# Altium project eps2_project.prjpcb (part 9 of 9)

## Sheet 6_battery_heater_controller.schdoc: Batteries Heater Controller and RTD ADC
size A4; Designed by: Andre M. P. Mattos; ProjectRevision: v0.3; Organization: UFSC; DocumentNumber: 7; Revision: v0.3; SheetNumber: 7; SheetTotal: 11; ProjectCode: EPS2
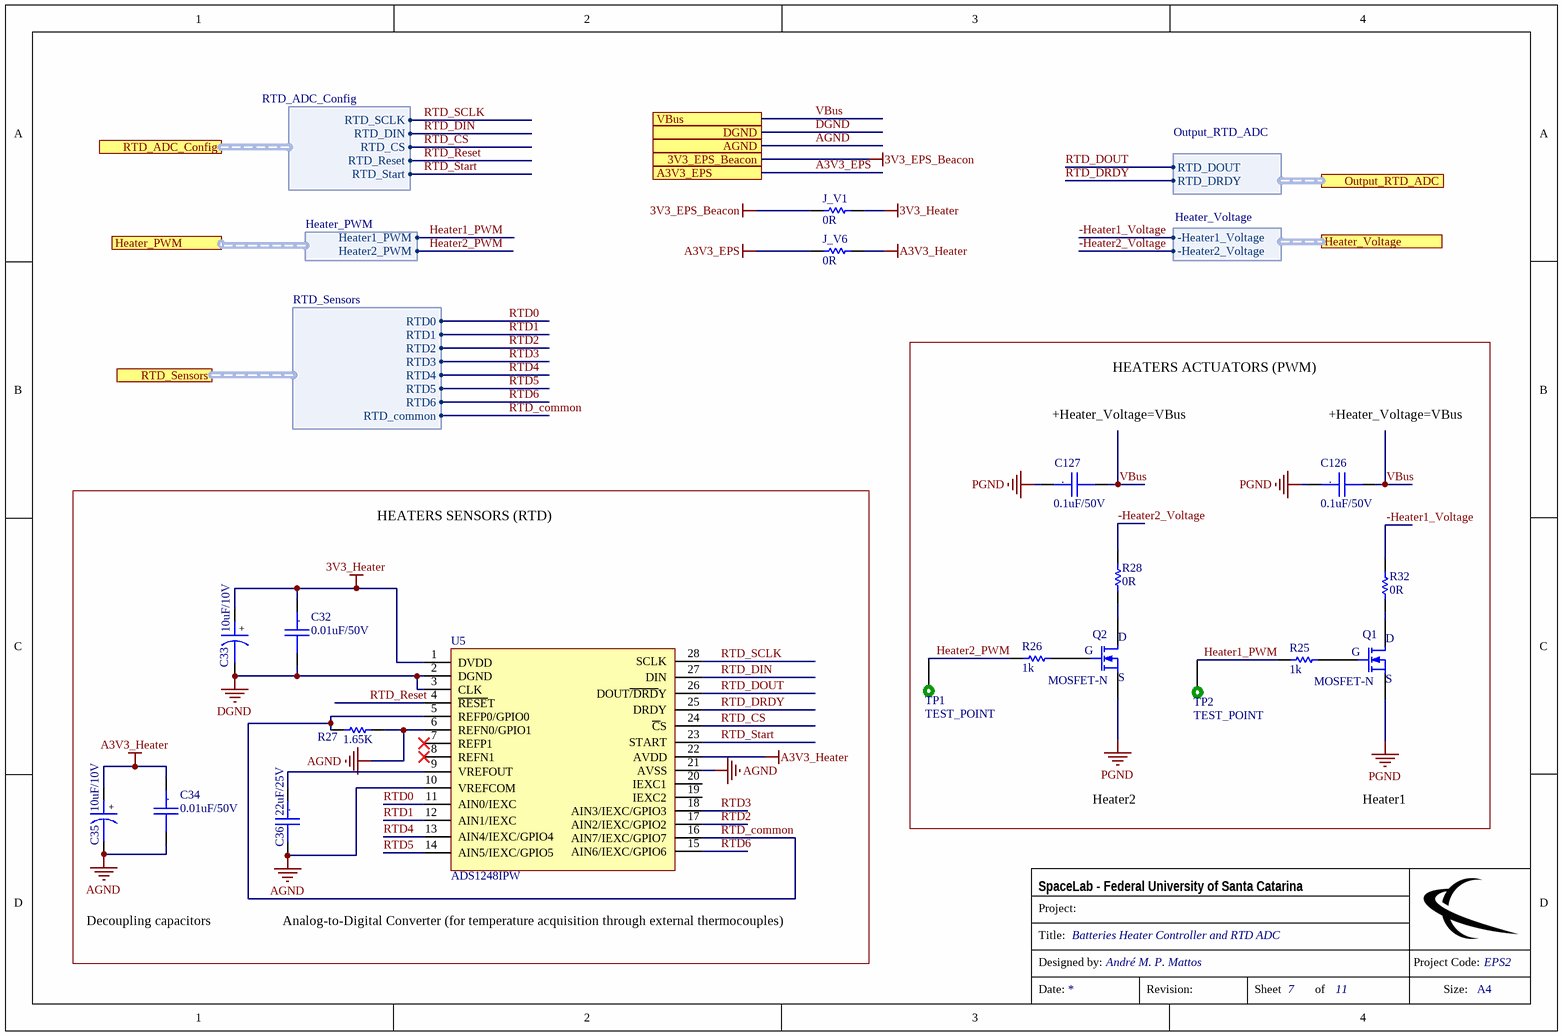
[diagram p10: 6_battery_heater_controller.schdoc]

### Parts
C32  0.01uF/50V  [CC0805]
C33  10uF/10V  [CC0805_Tantalum]
C34  0.01uF/50V  [CC0805]
C35  10uF/10V  [CC0805_Tantalum]
C36  22uF/25V  [CC1210]
C126  0.1uF/50V  [CC0805]
C127  0.1uF/50V  [CC0805]
J_V1  0R  [0805]
J_V6  0R  [0805]
Q1  MOSFET-N  [SOIC8_Mosfet]
Q2  MOSFET-N  [SOIC8_Mosfet]
R25  1k  [0805]
R26  1k  [0805]
R27  1.65K  [0805]
R28  0R  [0805]
R32  0R  [0805]
TP1  TEST_POINT  [TEST_POINT]  (no BOM)
TP2  TEST_POINT  [TEST_POINT]  (no BOM)
U5  ADS1248IPW  [TSSOP28]

### Blocks framed on the sheet
HEATERS ACTUATORS (PWM): C126 C127 Q1 Q2 R25 R26 R28 R32 TP1 TP2
HEATERS SENSORS (RTD): C32-C36 R27 U5

### Ports
3V3_EPS_Beacon, A3V3_EPS, AGND, DGND, Heater_PWM (harness Heater_PWM), Heater_Voltage (harness Heater_Voltage), Output_RTD_ADC (harness Output_RTD_ADC), RTD_ADC_Config (harness RTD_ADC_Config), RTD_Sensors (harness RTD_Sensors), VBus

### Harnesses
Output_RTD_ADC: RTD_DOUT, RTD_DRDY
RTD_ADC_Config: RTD_SCLK, RTD_DIN, RTD_CS, RTD_Reset, RTD_Start
RTD_Sensors: RTD1, RTD2, RTD3, RTD4, RTD5, RTD6, RTD0, RTD_common
Heater_PWM: Heater1_PWM, Heater2_PWM
Heater_Voltage: -Heater1_Voltage, -Heater2_Voltage

### Nets
3V3_EPS_Beacon: J_V1.2 ; port 3V3_EPS_Beacon
3V3_Heater: C32.1 C33.1 J_V1.1 U5.1(DVDD)
A3V3_EPS: J_V6.2 ; port A3V3_EPS
A3V3_Heater: C34.1 C35.1 J_V6.1 U5.22(AVDD)
AGND: C34.2 C35.2 C36.2 R27.1 U5.6(REFN0/GPIO1) U5.10(VREFCOM) U5.21(AVSS) ; port AGND
DGND: C32.2 C33.2 U5.2(DGND) U5.3(CLK) ; port DGND
PGND: C126.1 C127.1 Q1.1(S) Q2.1(S)
-Heater1_Voltage: R32.1 ; port Heater_Voltage.-Heater1_Voltage
-Heater2_Voltage: R28.1 ; port Heater_Voltage.-Heater2_Voltage
Heater1_PWM: R25.2 TP2.1 ; port Heater_PWM.Heater1_PWM
Heater2_PWM: R26.2 TP1.1 ; port Heater_PWM.Heater2_PWM
RTD0: U5.11(AIN0/IEXC) ; port RTD_Sensors.RTD0
RTD1: U5.12(AIN1/IEXC) ; port RTD_Sensors.RTD1
RTD2: U5.17(AIN2/IEXC/GPIO2) ; port RTD_Sensors.RTD2
RTD3: U5.18(AIN3/IEXC/GPIO3) ; port RTD_Sensors.RTD3
RTD4: U5.13(AIN4/IEXC/GPIO4) ; port RTD_Sensors.RTD4
RTD5: U5.14(AIN5/IEXC/GPIO5) ; port RTD_Sensors.RTD5
RTD6: U5.15(AIN6/IEXC/GPIO6) ; port RTD_Sensors.RTD6
RTD_common: R27.2 U5.5(REFP0/GPIO0) U5.16(AIN7/IEXC/GPIO7) ; port RTD_Sensors.RTD_common
RTD_CS: U5.24(~{C}S) ; port RTD_ADC_Config.RTD_CS
RTD_DIN: U5.27(DIN) ; port RTD_ADC_Config.RTD_DIN
RTD_DOUT: U5.26(DOUT~{/DRD}Y) ; port Output_RTD_ADC.RTD_DOUT
RTD_DRDY: U5.25(DRDY) ; port Output_RTD_ADC.RTD_DRDY
RTD_Reset: U5.4(~{RESE}T) ; port RTD_ADC_Config.RTD_Reset
RTD_SCLK: U5.28(SCLK) ; port RTD_ADC_Config.RTD_SCLK
RTD_Start: U5.23(START) ; port RTD_ADC_Config.RTD_Start
VBus: C126.2 C127.2 ; port VBus
NetC36_1: C36.1 U5.9(VREFOUT)
NetQ1_2: Q1.2(G) R25.1
NetQ1_3: Q1.3(D) R32.2
NetQ2_2: Q2.2(G) R26.1
NetQ2_3: Q2.3(D) R28.2

Not connected (* = marked no-connect by the designer): U5 7(REFP1)* 8(REFN1)* 19(IEXC2) 20(IEXC1)

### Notes on the sheet
- +Heater_Voltage=VBus
- Heater2
- Heater1
- Decoupling capacitors
- Analog-to-Digital Converter (for temperature acquisition through external thermocouples)
- Project:
- SpaceLab - Federal University of Santa Catarina
- Title:
- Designed by:
- Project Code:
- Date:
- Revision:
- Sheet
- of
- Size:
- A4
- (in symbol Cap_Cer_X7R_0.01uF_50V_0805) .
- (in symbol Cap_Cer_X7R_0.1uF_50V_0805) .
- (in symbol Cap_Cer_X7R_22uF_25V_1210) .
- (in symbol Cap_Tant_SMD_10uF_6V3_0805) +

### Library data of the parts
C32 C34 = Cap_Cer_X7R_0.01uF_50V_0805: CAP CER 0.01uF 50V 10% X7R 0805; Partnumber: 08055C103KAT4A; Manufacturer: Kyocera AVX; Capacitance: 10nF; NCM: 8532.24.10; Case/Package: 0805; Case Code (Imperial): 0805; Case Code (Metric): 2012; ComponentLink1Description: http://www.mouser.com/ds/2/40/X7RDielectric-777024.pdf?src-supplier=Mouser; ComponentLink1URL: http://www.mouser.com/ds/2/40/X7RDielectric-777024.pdf?src-supplier=Mouser; ComponentLink2Description: http://www.avx.com/docs/Catalogs/cx7r.pdf?src-supplier=Future+Electronics; ComponentLink2URL: http://www.avx.com/docs/Catalogs/cx7r.pdf?src-supplier=Future+Electronics; Depth: 1.25mm; Dielectric: X7R; Height: 0.94mm; Lead Free: Lead Free; Length: 2.01mm; Manufacturer Part Number: 08055C103KAT4A; Max Operating Temperature: 125°C; Min Operating Temperature: -55°C; Mount: Surface Mount; Number of Pins: 2; Packaging: Tape and Reel; Pricing 1: 1=0.12, 10=0.085, 100=0.04, 500=0.028, 1000=0.023, 2500=0.018 (USD); Pricing 2: 1=0.13, 10=0.09, 50=0.0508, 100=0.0421, 500=0.02952, 1000=0.02444, 2500=0.02275, 5000=0.02081 (USD); Radiation Hardening: No; Stock 1: 88198; Stock 2: 515319; Supplier 1: Mouser; Supplier 2: Digi-Key; Supplier Part Number 1: 581-08055C103KAT4A; Supplier Part Number 2: 478-10687-1-ND; Termination: SMD/SMT; Tolerance: 10%; Voltage: 50V; Voltage Rating (DC): 50V; Voltage Rating: 50V; Weight: 0.000194oz; Width: 1.25mm
C33 C35 = Cap_Tant_SMD_10uF_6V3_0805: CAP Tantalum 10uF 6.3V 10% 0805; Partnumber: TPSR106K006R1000; Manufacturer: Kyocera AVX; Dissipation Factor: 8%; ESR (Equivalent Series Resistance): 1R; Polarity: Polar; NCM: 8532.21.11; Capacitance: 10uF; Case/Package: 0805; Case Code (Imperial): 0805; Case Code (Metric): 2012; ComponentLink1Description: http://www.avx.com/docs/Catalogs/packmark.pdf?src-supplier=Element14; ComponentLink1URL: http://www.avx.com/docs/Catalogs/packmark.pdf?src-supplier=Element14; ComponentLink2Description: http://www.farnell.com/datasheets/1441576.pdf?src-supplier=Element14; ComponentLink2URL: http://www.farnell.com/datasheets/1441576.pdf?src-supplier=Element14; ComponentLink3Description: http://datasheets.avx.com/TPS.pdf?src-supplier=Digi-Key; ComponentLink3URL: http://datasheets.avx.com/TPS.pdf?src-supplier=Digi-Key; Depth: 1.3mm; Dielectric Material: Tantalum; Features: General Purpose; Height - Seated (Max): 0.047inch; Height: 1.2mm; Lead Free: Lead Free; Length: 2.05mm; Manufacturer Part Number: TPSR106K006R1000; Max Operating Temperature: 125°C; Min Operating Temperature: -55°C; Mount: Surface Mount; Package Quantity: 1; Packaging: Tape and Reel; Pricing 1: 1=0.76, 10=0.561, 100=0.384, 500=0.304, 1000=0.256, 2500=0.237 (USD); Pricing 2: 1=0.73, 10=0.536, 50=0.429, 100=0.3678, 500=0.29114, 1000=0.24517 (USD); Radiation Hardening: No; REACH SVHC: No SVHC; Stock 1: 0; Stock 2: 0; Supplier 1: Mouser; Supplier 2: Digi-Key; Supplier Part Number 1: 581-TPSR106K006R1000; Supplier Part Number 2: 478-9265-1-ND; Termination: SMD/SMT; Tolerance: 10%; Voltage Rating: 6.3V; Width: 0.051inch
C36 = Cap_Cer_X7R_22uF_25V_1210: CAP CER 22uF 25V 10% X7R 1210; Partnumber: GRM32ER71E226KE15L; Manufacturer: Murata; Material: Ceramic; Capacitance: 22uF; Case/Package: 1210; Case Code (Imperial): 1210; Case Code (Metric): 3225; ComponentLink1Description: http://www.farnell.com/datasheets/2048964.pdf?src-supplier=Farnell; ComponentLink1URL: http://www.farnell.com/datasheets/2048964.pdf?src-supplier=Farnell; ComponentLink2Description: http://psearch.murata.com/capacitor/product/GRM32ER71E226KE15%23.pdf?src-supplier=Future+Electronics; ComponentLink2URL: http://psearch.murata.com/capacitor/product/GRM32ER71E226KE15%23.pdf?src-supplier=Future+Electronics; ComponentLink3Description: https://www.murata.com/~/media/webrenewal/support/library/catalog/products/capacitor/mlcc/c02e.ashx?la=en-us&src-supplier=Digi-Key; ComponentLink3URL: https://www.murata.com/~/media/webrenewal/support/library/catalog/products/capacitor/mlcc/c02e.ashx?la=en-us&src-supplier=Digi-Key; ComponentLink4Description: http://components.arrow.com/part/dataview/47905228S8888111N2606?src-supplier=Arrow; ComponentLink4URL: http://components.arrow.com/part/dataview/47905228S8888111N2606?src-supplier=Arrow; ComponentLink5Description: http://www.farnell.com/datasheets/2048964.pdf?src-supplier=Element14; ComponentLink5URL: http://www.farnell.com/datasheets/2048964.pdf?src-supplier=Element14; ComponentLink6Description: http://uk.rs-online.com/webdocs/13d2/0900766b813d2caa.pdf?src-supplier=RSComponents; ComponentLink6URL: http://uk.rs-online.com/webdocs/13d2/0900766b813d2caa.pdf?src-supplier=RSComponents; ComponentLink7Description: https://produktinfo.conrad.com/datenblaetter/450000-474999/451826-da-01-de-VS_KONDENS_GRM32_ER71E_226KE15L.pdf?src-supplier=Conrad; ComponentLink7URL: https://produktinfo.conrad.com/datenblaetter/450000-474999/451826-da-01-de-VS_KONDENS_GRM32_ER71E_226KE15L.pdf?src-supplier=Conrad; Depth: 2.5mm; Dielectric: X7R; Height: 2.5mm; Lead Free: Lead Free; Length: 3.2mm; Manufacturer Part Number: GRM32ER71E226KE15L; Max Operating Temperature: 125°C; Min Operating Temperature: -55°C; Mount: Surface Mount; Number of Pins: 2; Package Quantity: 1; Packaging: Tape and Reel; Pricing 1: 1=1.96, 10=1.54, 25=1.54, 100=1.15, 250=1.15, 500=0.876 (USD); Pricing 2: 1=1.87, 10=1.479, 50=1.2816, 100=1.1091, 500=0.83802 (USD); Radiation Hardening: No; REACH SVHC: No SVHC; Stock 1: 169862; Stock 2: 0; Supplier 1: Mouser; Supplier 2: Digi-Key; Supplier Part Number 1: 81-GRM32ER71E226KE5L; Supplier Part Number 2: 490-5313-1-ND; Termination: SMD/SMT; Thickness: 0.106inch; Tolerance: 10%; Voltage: 25V; Voltage Rating (DC): 25V; Voltage Rating: 25V; Width: 0.098inch
C126 C127 = Cap_Cer_X7R_0.1uF_50V_0805: CAP CER 0.1UF 50V 10% X7R 0805; Partnumber: CC0805KRX7R9BB104; Manufacturer: Yageo; Capacitance: 100nF; Insulation Resistance: 100GR; Material: Ceramic; Case/Package: 0805; Case Code (Imperial): 0805; Case Code (Metric): 2012; ComponentLink1Description: http://www.yageo.com/documents/recent/UPY-GPHC_X7R_6.3V-to-50V_8.pdf?src-supplier=Avnet; ComponentLink1URL: http://www.yageo.com/documents/recent/UPY-GPHC_X7R_6.3V-to-50V_8.pdf?src-supplier=Avnet; ComponentLink2Description: http://www.farnell.com/datasheets/1489800.pdf?src-supplier=Element14; ComponentLink2URL: http://www.farnell.com/datasheets/1489800.pdf?src-supplier=Element14; ComponentLink3Description: http://www.yageo.com/documents/recent/UPY-GPHC_X7R_6.3V-to-50V_18.pdf?src-supplier=Digi-Key; ComponentLink3URL: http://www.yageo.com/documents/recent/UPY-GPHC_X7R_6.3V-to-50V_18.pdf?src-supplier=Digi-Key; ComponentLink4Description: http://www.farnell.com/datasheets/2167236.pdf?src-supplier=Element14; ComponentLink4URL: http://www.farnell.com/datasheets/2167236.pdf?src-supplier=Element14; ComponentLink5Description: http://www.yageo.com/documents/recent/UPY-GPHC_X7R_6.3V-to-50V_8.pdf?src-supplier=Avnet+Europe; ComponentLink5URL: http://www.yageo.com/documents/recent/UPY-GPHC_X7R_6.3V-to-50V_8.pdf?src-supplier=Avnet+Europe; ComponentLink6Description: http://www.produktinfo.conrad.com/datenblaetter/425000-449999/445210-da-01-en-KERKO_CHIP_0805_X7R_0_1uF_10Proz_50VG.pdf?src-supplier=Conrad; ComponentLink6URL: http://www.produktinfo.conrad.com/datenblaetter/425000-449999/445210-da-01-en-KERKO_CHIP_0805_X7R_0_1uF_10Proz_50VG.pdf?src-supplier=Conrad; Depth: 1.25mm; Dielectric: X7R; Halogen Free: Halogen Free; Height: 0.85mm; Lead Free: Lead Free; Length: 2mm; Manufacturer Part Number: CC0805KRX7R9BB104; Max Operating Temperature: 125°C; Min Operating Temperature: -55°C; Mount: Surface Mount; Number of Pins: 2; Package Quantity: 1; Packaging: Tape and Reel; Pricing 1: 1=0.12, 10=0.087, 100=0.028, 1000=0.023, 4000=0.018, 8000=0.017 (USD); Pricing 2: 1=0.12, 10=0.088, 50=0.05, 100=0.0414, 500=0.02906, 1000=0.02405 (USD); Radiation Hardening: No; REACH SVHC: No SVHC; Stock 1: 3904445; Stock 2: 544494; Supplier 1: Mouser; Supplier 2: Digi-Key; Supplier Part Number 1: 603-CC805KRX7R9BB104; Supplier Part Number 2: 311-1140-1-ND; Termination: SMD/SMT; Thickness: 0.033inch; Tolerance: 10%; Voltage: 50V; Voltage Rating: 50V; Width: 0.049inch
J_V1 J_V6 R28 R32 = R0R_JUMPER_1/8W_0805: RES 0R OHM 1/8W JUMPER 0805; Partnumber: CRCW08050000Z0EA; Manufacturer: Vishay; Max Power Dissipation: 125mW; Resistance: 0mR; Temperature Coefficient: 100ppm/°C; Tolerance: 1%; Voltage Rating (DC): 150V; Fitted: No (jumper resistor); Case/Package: 0805; Case Code (Imperial): 0805; Case Code (Metric): 2012; ComponentLink1Description: http://www.vishay.com/docs/20035/dcrcwe3.pdf?src-supplier=Avnet+Europe; ComponentLink1URL: http://www.vishay.com/docs/20035/dcrcwe3.pdf?src-supplier=Avnet+Europe; ComponentLink2Description: http://www.vishay.com/docs/20035/dcrcwe3.pdf?src-supplier=Distrelec; ComponentLink2URL: http://www.vishay.com/docs/20035/dcrcwe3.pdf?src-supplier=Distrelec; ComponentLink3Description: http://www.vishay.com/docs/20035/dcrcwe3.pdf?src-supplier=Mouser; ComponentLink3URL: http://www.vishay.com/docs/20035/dcrcwe3.pdf?src-supplier=Mouser; ComponentLink4Description: http://uk.rs-online.com/webdocs/0d98/0900766b80d98b26.pdf?src-supplier=RSComponents; ComponentLink4URL: http://uk.rs-online.com/webdocs/0d98/0900766b80d98b26.pdf?src-supplier=RSComponents; ComponentLink5Description: http://www.vishay.com/docs/20035/dcrcwe3.pdf?src-supplier=Future+Electronics; ComponentLink5URL: http://www.vishay.com/docs/20035/dcrcwe3.pdf?src-supplier=Future+Electronics; ComponentLink6Description: http://www.vishay.com/docs/20035/dcrcwe3.pdf?src-supplier=Allied+Electronics; ComponentLink6URL: http://www.vishay.com/docs/20035/dcrcwe3.pdf?src-supplier=Allied+Electronics; ComponentLink7Description: http://www.vishay.com/docs/20035/dcrcwe3.pdf?src-supplier=Digi-Key; ComponentLink7URL: http://www.vishay.com/docs/20035/dcrcwe3.pdf?src-supplier=Digi-Key; ComponentLink8Description: http://www.farnell.com/datasheets/2310790.pdf?src-supplier=Element14; ComponentLink8URL: http://www.farnell.com/datasheets/2310790.pdf?src-supplier=Element14; Composition: Thick Film; Contact Plating: Tin,Lead; Depth: 1.25mm; Features: Automotive AEC-Q200; Height: 0.45mm; Lead Free: Lead Free; Length: 2mm; Manufacturer Part Number: CRCW08050000Z0EA; Max Operating Temperature: 155°C; Military Standard: Not; Min Operating Temperature: -55°C; Number of Terminations: 2; Package Quantity: 1; Packaging: Tape and Reel; Power Rating: 125mW; Pricing 1: 1=0.1, 10=0.024, 100=0.01, 1000=0.007, 5000=0.004, 10000=0.004 (USD); Pricing 2: 1=0.1, 10=0.04, 25=0.0288, 50=0.022, 100=0.0162, 250=0.01236, 500=0.0099, 1000=0.00729 (USD); Radiation Hardening: No; REACH SVHC: Unknown; Stock 1: 903478; Stock 2: 399530; Supplier 1: Mouser; Supplier 2: Digi-Key; Supplier Part Number 1: 71-CRCW0805-0-E3; Supplier Part Number 2: 541-0.0ADKR-ND; Termination: SMD/SMT; Voltage Rating: 150V; Weight: 0.000194oz; Width: 1.25mm
Q1 Q2 = MOSFET-N_30V_SI4166DY: MOSFET N-Channel 30V Vds 20V Vgs SO-8; Partnumber: SI4166DY-T1-GE3; Manufacturer: Vishay Siliconix; Rds On Max: 3.9mR; Input Capacitance: 2.73nF; Rise Time: 19ns; Continuous Drain Current (ID): 20.5A; Max Power Dissipation: 6.5W; Drain to Source Resistance: 4.5mR; Fall Time: 15ns; Turn-Off Delay Time: 35ns; Turn-On Delay Time: 30ns; Threshold Voltage: 1.2V; Number of Elements: 1; Power Dissipation: 3W; Published: 8-Jun-2000; LatestRevisionDate: 17-Jul-2002; LatestRevisionNote: Re-released for DXP Platform.; PackageVersion: 1995/1996; PackageReference: E3; Publisher: Altium Limited; PackageDescription: TO, Flat Index; 3 In-Line, Axial Leads; Body Dia. 4.6mm; Lead Dia. 0.5 mm (max); Supplier 1: Mouser; Supplier Part Number 1: 781-SI4166DY-T1-GE3; Stock 1: 3322; Pricing 1: 1=1.43, 10=1.21, 100=0.952, 500=0.799, 1000=0.648, 2500=0.648 (USD); Mount: Surface Mount; Case/Package: SOIC; Number of Pins: 8; Weight: 0.006596oz; Contact Plating: Tin,Matte; Min Operating Temperature: -55°C; Max Operating Temperature: 150°C; Package Quantity: 1; Packaging: Tape and Reel; Drain to Source Voltage (Vdss): 30V; Drain to Source Breakdown Voltage: 30V; Gate to Source Voltage (Vgs): 20V; Number of Channels: 1; On-State Resistance: 3.9MR; Length: 5mm; Height: 1.55mm; Width: 4mm; Radiation Hardening: No; REACH SVHC: Unknown; Lead Free: Lead Free; ComponentLink1URL: http://www.vishay.com/docs/68953/si4166dy.pdf?src-supplier=Digi-Key; ComponentLink1Description: http://www.vishay.com/docs/68953/si4166dy.pdf?src-supplier=Digi-Key; ComponentLink2URL: http://www.vishay.com/docs/68953/si4166dy.pdf?src-supplier=Future+Electronics; ComponentLink2Description: http://www.vishay.com/docs/68953/si4166dy.pdf?src-supplier=Future+Electronics; ComponentLink3URL: http://www.mouser.com/ds/2/427/si4166dy-244566.pdf?src-supplier=Mouser; ComponentLink3Description: http://www.mouser.com/ds/2/427/si4166dy-244566.pdf?src-supplier=Mouser; Supplier 2: Digi-Key; Supplier Part Number 2: SI4166DY-T1-GE3CT-ND; Stock 2: 1522; Pricing 2: 1=1.39, 10=1.239, 25=1.176, 100=0.882, 250=0.8736, 500=0.7476, 1000=0.609 (USD); Manufacturer Part Number: SI4166DY-T1-GE3
R25 R26 = R1.0k_1%_1/8W_0805: RES SMD 1K OHM 1% 1/8W 0805; Manufacturer: Panasonic; Manufacturer Part Number: ERJ-6ENF1001V; Resistance: 1kR; Temperature Coefficient: 100ppm/°C; Power Rating: 125mW; Voltage Rating (DC): 150V; Supplier 1: Mouser; Supplier Part Number 1: 667-ERJ-6ENF1001V; Stock 1: 604781; Pricing 1: 1=0.13, 10=0.072, 100=0.028, 1000=0.019, 5000=0.018, 10000=0.018 (USD); Mount: Surface Mount; Case/Package: 0805; Number of Pins: 2; Min Operating Temperature: -55°C; Max Operating Temperature: 155°C; Tolerance: 1%; Packaging: Cut Tape; Number of Terminations: 2; Working Voltage: 150V; Length: 2mm; Height: 0.6mm; Depth: 1.25mm; Width: 1.25mm; REACH SVHC: No SVHC; Lead Free: Lead Free; Supplier 2: Digi-Key; Supplier Part Number 2: P1.00KCCT-ND; Stock 2: 447460; Pricing 2: 1=0.1, 10=0.072, 100=0.0275, 1000=0.0121, 2500=0.01045 (USD)
R27 = R1.65K_1%_1/10W_0805: RES 1.65K OHM 1/10W 0.1% 0805; Partnumber: PCF0805R-1K65BT1; Manufacturer: TT Welwyn; Max Power Dissipation: 100mW; Resistance: 1.65kR; Temperature Coefficient: 25ppm/°C; Voltage Rating: 100V; NCM: 8533.21.20; Case/Package: 0805; Case Code (Imperial): 0805; Case Code (Metric): 2012; ComponentLink1Description: http://www.ttelectronicsresistors.com/datasheets/pcf.pdf?src-supplier=Digi-Key; ComponentLink1URL: http://www.ttelectronicsresistors.com/datasheets/pcf.pdf?src-supplier=Digi-Key; ComponentLink2Description: http://www.mouser.com/ds/2/414/PCF-437472.pdf?src-supplier=Mouser; ComponentLink2URL: http://www.mouser.com/ds/2/414/PCF-437472.pdf?src-supplier=Mouser; Composition: Metal Film; Depth: 1.25mm; Height: 0.026inch; Length: 2mm; Manufacturer Part Number: PCF0805R-1K65BT1; Max Operating Temperature: 125°C; Military Standard: Not; Min Operating Temperature: -55°C; Number of Terminations: 2; Package Quantity: 1000; Packaging: Tape and Reel; Power Rating: 100mW; Pricing 2: 1=0.61, 10=0.471, 25=0.358 (USD); Stock 1: 0; Stock 2: 42; Supplier 1: Mouser; Supplier 2: Digi-Key; Supplier Part Number 1: 756-PCF0805R-1K65BT1; Supplier Part Number 2: 985-1304-1-ND; Tolerance: 0.1%; Width: 0.049inch
TP1 TP2 = TEST_POINT: Test point
U5 = ADS1248IPW: 24 bit ADC Differential Input, SPI, 28-pin TSSOP; Manufacturer: Texas Instruments; Part_Number: ADS1248IPWR; Number of Bits: 24; Sampling Rate (Per Second): 2k; Number of Inputs: 4, 7; Input Type: Differential, Single Ended; Configuration: MUX-PGA-ADC; Number of A/D Converters: 1; Architecture: Sigma-Delta; Reference Type: External, Internal; Voltage - Supply, Analog: 2.7 V ~ 5.25 V; Conversion Rate: 2KS/s; Differential Nonlinearity: 1LSB; Dual Supply Voltage: 2.5V; Max Power Dissipation: 2.3mW; Max Supply Voltage (DC): 5.25V; Max Supply Voltage: 5V; Min Supply Voltage (DC): 2.7V; Min Supply Voltage: 3V; Number of Channels: 4; Operating Supply Voltage: 3.3V; Polarity: Bipolar; Resolution: 24b; Supply Type: Dual,Analog,Digital,Single; Datasheet: *; Supplier: RS Online; Supplier_Link: http://uk.rs-online.com/web/p/general-purpose-adcs/7091921/?searchTerm=ads1248&relevancy-data=636F3D3226696E3D4931384E4B6E6F776E41734D504E266C753D656E266D6D3D6D61746368616C6C7061727469616C26706D3D5E5B5C707B4C7D5C707B4E647D2D2C2F255C2E5D2B2426706F3D313326736E3D592673743D4D414E5F504152545F4E554D4245522677633D424F5448267573743D6164733132343826; Supplier_Part_Number: 709-1921; Price: £7.51; Supplier 1: Digi-Key; Manufacturer Part Number: ADS1248IPW; RoHS: RoHS Compliant; Category: Integrated Circuits (ICs); Stock 1: 1835; Pricing 1: 1=10.49, 10=9.535, 25=8.822, 50=8.3402, 100=8.0994, 250=7.38576, 500=6.91298, 750=6.58295, 1000=5.96079 (EUR); Packaging: Tube; Data Interface: SPI; Ratio - S/H:ADC: -; Voltage - Supply, Digital: 2.7 V ~ 5.25 V; Features: PGA, Temperature Sensor; Operating Temperature: -40°C ~ 105°C; Package / Case: 28-TSSOP (0.173", 4.40mm Width); Supplier Device Package: 28-TSSOP; ComponentLink1URL: http://www.ti.com/lit/ds/symlink/ads1246.pdf; ComponentLink1Description: http://www.ti.com/lit/ds/symlink/ads1246.pdf; Supplier 2: Farnell; Supplier 3: Newark; Supplier Part Number 1: 296-24294-5-ND; Supplier Part Number 2: 1735557; Supplier Part Number 3: 05R0320; partnumber: ADS1248IPWR; Case/Package: TSSOP; ComponentLink2Description: http://www.ti.com/lit/ds/symlink/ads1246.pdf?src-supplier=Digi-Key; ComponentLink2URL: http://www.ti.com/lit/ds/symlink/ads1246.pdf?src-supplier=Digi-Key; ComponentLink3Description: http://datasheet.iiic.cc/texas_instruments/ADS1248IPWR.pdf?src-supplier=IIIC; ComponentLink3URL: http://datasheet.iiic.cc/texas_instruments/ADS1248IPWR.pdf?src-supplier=IIIC; Contact Plating: Gold; Interface: SPI; Lead Free: Lead Free; Max Operating Temperature: 105°C; Min Operating Temperature: -40°C; Number of Converters: 1; Number of Elements: 1; Number of Pins: 28; Package Quantity: 2000; Power Consumption: 2.3mW; Power Dissipation: 2.3mW; Pricing 4: 1=10.58, 10=9.56, 25=9.12, 100=7.56, 250=6.89, 500=6.45 (USD); Pricing 5: 1=10.58, 10=9.555, 25=9.1104, 100=7.5548, 250=6.8882, 500=6.4438, 1000=5.7772 (USD); Radiation Hardening: No; REACH SVHC: No SVHC; Sampling Rate: 2KS/s; Stock 4: 4553; Stock 5: 5158; Supplier 4: Mouser; Supplier 5: Digi-Key; Supplier Part Number 4: 595-ADS1248IPWR; Supplier Part Number 5: 296-38852-1-ND

## Nets that join several sheets
3V3_EPS_Beacon: 1_interface (PC104.H2-27 PC104.H2-28), 5_mcu_main (J_V3.2), 7_dc_dc_3v3_eps_ttc (3V3EPS.1 C50.1 FB1.1 Rsense3.2), 6_battery_heater_controller (J_V1.2)
3V3_M: 3_measurement_and_mppt (37 pins), 7_dc_dc_3v3_eps_ttc (C71.2 C130.1 U27.1 U27.6), 4_battery_monitoring_and_switches (C121.2 U26.5 U26.6)
3V3_MCU: 1_interface (CN1.2), 5_mcu_main (21 pins)
A3V3_EPS: 3_measurement_and_mppt (J_V5.2), 5_mcu_main (7 pins), 7_dc_dc_3v3_eps_ttc (C51.1 FB1.2), 6_battery_heater_controller (J_V6.2)
AGND: 1_interface (FB4.1), 3_measurement_and_mppt (56 pins), 5_mcu_main (11 pins), 7_dc_dc_3v3_eps_ttc (7 pins), 4_battery_monitoring_and_switches (5 pins), 6_battery_heater_controller (7 pins)
DGND: 1_interface (11 pins), 5_mcu_main (24 pins), 6_battery_heater_controller (C32.2 C33.2 U5.2 U5.3)
PGND: 1_interface (17 pins), 3_measurement_and_mppt (11 pins), 7_dc_dc_5v_payloads (10 pins), 7_dc_dc_3v3_eps_ttc (11 pins), 7_dc_dc_3v3_ant_obdh (20 pins), 7_dc_dc_5v_radios (30 pins), 4_battery_monitoring_and_switches (8 pins), 6_battery_heater_controller (C126.1 C127.1 Q1.1 Q2.1)
3V3_Deployment_ANT: 1_interface (PC104.H2-35 PC104.H2-36), 7_dc_dc_3v3_ant_obdh (R21.1)
3V3_OBDH: 1_interface (PC104.H1-45 PC104.H1-46), 7_dc_dc_3v3_ant_obdh (R16.1)
5V_Payload: 1_interface (PC104.H1-47 PC104.H1-48 PC104.H2-25 PC104.H2-26), 7_dc_dc_5v_payloads (5V.1 R55.1)
+RBF: 1_interface (14 pins), 4_battery_monitoring_and_switches (6 pins)
-Heater1_Voltage: 1_interface (P8.7 P8.8), 6_battery_heater_controller (R32.1)
-Heater2_Voltage: 1_interface (P8.3 P8.4), 6_battery_heater_controller (R28.1)
-RBF: 1_interface (6 pins), 4_battery_monitoring_and_switches (Q3.2 Q4.2 Q5.2 Q6.2)
-VBat: 1_interface (8 pins), 4_battery_monitoring_and_switches (C40.2 C41.2 R47.1)
ADC1_I: 3_measurement_and_mppt (C73.1 R67.2 U15.2), 5_mcu_main (U12.97)
ADC1_V: 3_measurement_and_mppt (C84.2 U17.3 U17.4), 5_mcu_main (U12.5)
ADC2_I: 3_measurement_and_mppt (C75.1 R68.2 U16.2), 5_mcu_main (U12.98)
ADC2_V: 3_measurement_and_mppt (C91.2 U21.3 U21.4), 5_mcu_main (U12.6)
ADC3_I: 3_measurement_and_mppt (C85.1 R72.2 U18.2), 5_mcu_main (U12.99)
ADC3_V: 3_measurement_and_mppt (C99.2 U24.3 U24.4), 5_mcu_main (U12.7)
ADC4_I: 3_measurement_and_mppt (C89.1 R75.2 U20.2), 5_mcu_main (U12.100)
ADC5_I: 3_measurement_and_mppt (C94.1 R79.2 U22.2), 5_mcu_main (U12.1)
ADC6_I: 3_measurement_and_mppt (C100.1 R83#1.2 U25.2), 5_mcu_main (U12.2)
ADC7_I: 5_mcu_main (U12.3), 7_dc_dc_3v3_eps_ttc (C129.1 R36.2 U27.2)
ADC_BUS: 5_mcu_main (U12.4), 4_battery_monitoring_and_switches (C119.2 U26.3 U26.4)
ADC_TOTAL_V: 3_measurement_and_mppt (C87.2 U19.3 U19.4), 5_mcu_main (U12.8)
BAT_GPIO1: 1_interface (RTD1.1), 5_mcu_main (U12.39)
BAT_GPIO2: 1_interface (RTD1.2), 5_mcu_main (U12.40)
En_Payload: 5_mcu_main (U12.37), 7_dc_dc_5v_payloads (U10.5)
ESD: 0_architecture (MEC4.0), 1_interface (R_ESD.2)
Heater1_PWM: 5_mcu_main (U12.45), 6_battery_heater_controller (R25.2 TP2.1)
Heater2_PWM: 5_mcu_main (U12.44), 6_battery_heater_controller (R26.2 TP1.1)
I2C0_SCL: 5_mcu_main (R84.2 U12.19), 4_battery_monitoring_and_switches (R92.1)
I2C0_SDA: 5_mcu_main (R83#2.2 U12.18), 4_battery_monitoring_and_switches (R42.2)
I2C1_SCL_BUF: 1_interface (PC104.H2-51 R88.2), 5_mcu_main (U28.2)
I2C1_SDA_BUF: 1_interface (PC104.H2-49 R87.2), 5_mcu_main (U28.7)
MPPT_PWM_1: 3_measurement_and_mppt (Q8.2 TP6.1), 5_mcu_main (U12.51)
MPPT_PWM_2: 3_measurement_and_mppt (Q9.2 TP7.1), 5_mcu_main (U12.52)
MPPT_PWM_3: 3_measurement_and_mppt (Q10.2 TP9.1), 5_mcu_main (U12.53)
NC_Kill_Switch1: 1_interface (SW1.5 SW1.6), 4_battery_monitoring_and_switches (R35.1)
NC_Kill_Switch2: 1_interface (SW2.5 SW2.6), 4_battery_monitoring_and_switches (R85.1)
Panel+X: 1_interface (+X.3 +X.4), 3_measurement_and_mppt (D18.2)
Panel+Y: 1_interface (+Y.3 +Y.4), 3_measurement_and_mppt (D22.2)
Panel+Z: 1_interface (+Z.3 +Z.4), 3_measurement_and_mppt (D20.2)
Panel-X: 1_interface (-X.3 -X.4), 3_measurement_and_mppt (D19.2)
Panel-Y: 1_interface (-Y.3 -Y.4), 3_measurement_and_mppt (D17.2)
Panel-Z: 1_interface (-Z.3 -Z.4), 3_measurement_and_mppt (D21.2)
PC104_GPIO0: 1_interface (R89.2), 5_mcu_main (U12.24)
PC104_GPIO1: 1_interface (R90.2), 5_mcu_main (U12.23)
PC104_GPIO2: 1_interface (R91.2), 5_mcu_main (U12.20)
PIO: 5_mcu_main (R64.2 U12.17), 4_battery_monitoring_and_switches (D5.1 R44.2)
RTD0: 1_interface (RTD2.8), 6_battery_heater_controller (U5.11)
RTD1: 1_interface (RTD2.6), 6_battery_heater_controller (U5.12)
RTD2: 1_interface (RTD1.6), 6_battery_heater_controller (U5.17)
RTD3: 1_interface (RTD1.4), 6_battery_heater_controller (U5.18)
RTD4: 1_interface (RTD2.4), 6_battery_heater_controller (U5.13)
RTD5: 1_interface (RTD2.2), 6_battery_heater_controller (U5.14)
RTD6: 1_interface (RTD1.8), 6_battery_heater_controller (U5.15)
RTD_common: 1_interface (7 pins), 6_battery_heater_controller (R27.2 U5.5 U5.16)
RTD_CS: 5_mcu_main (U12.65), 6_battery_heater_controller (U5.24)
RTD_DIN: 5_mcu_main (U12.60), 6_battery_heater_controller (U5.27)
RTD_DOUT: 5_mcu_main (U12.61), 6_battery_heater_controller (U5.26)
RTD_DRDY: 5_mcu_main (U12.67), 6_battery_heater_controller (U5.25)
RTD_Reset: 5_mcu_main (U12.62), 6_battery_heater_controller (U5.4)
RTD_SCLK: 5_mcu_main (U12.59), 6_battery_heater_controller (U5.28)
RTD_Start: 5_mcu_main (U12.66), 6_battery_heater_controller (U5.23)
TCK: 1_interface (SBW.3), 5_mcu_main (U12.91)
TDO: 1_interface (SBW.2), 5_mcu_main (C57.1 R62.1 U12.96)
UART_Debug_Rx: 1_interface (SBW.5 UART.2), 5_mcu_main (U12.71)
UART_Debug_Tx: 1_interface (SBW.4 UART.1), 5_mcu_main (U12.70)
UART_EPS_RX_Beacon_TX: 1_interface (PC104.H2-7), 5_mcu_main (U12.22)
UART_EPS_TX_Beacon_RX: 1_interface (PC104.H2-5), 5_mcu_main (U12.21)
V_Charging_Batteries: 1_interface (P3.1 P3.2), 4_battery_monitoring_and_switches (7 pins)
VBat_Common: 1_interface (P1.9 P1.10 P5.9 P5.10), 4_battery_monitoring_and_switches (R43.1)
VBus: 1_interface (6 pins), 7_dc_dc_5v_payloads (R56.2), 7_dc_dc_3v3_eps_ttc (R50.2), 7_dc_dc_3v3_ant_obdh (R15.2 R20.2), 7_dc_dc_5v_radios (R2.2 R9.2), 4_battery_monitoring_and_switches (7 pins), 6_battery_heater_controller (C126.2 C127.2)
VPanels: 3_measurement_and_mppt (13 pins), 4_battery_monitoring_and_switches (Q3.1 Q4.1)

## Assembly variants
test_model: not fitted D8 D17 D18 J_V1 J_V3 J_V4 J_V5 J_V6 R2 R3 R9 R10 R15 R16 R20 R21 R28 R32 R46 R47 R50 R51 R55 R56 R93
flight_model: not fitted 3V3_ANT 3V3_EPS_BEACON 3V3_MCU 3V3_OBDH 5V_PAYLOADS_LED 5V_RADIO_0_LED 6V_RADIO_1_LED CN1 J_V4 P1 R87 R88 R89 R90 R91 R93 SYSTEM_ON UART VBUS_LED